# Altium project Encoder.PrjPCB
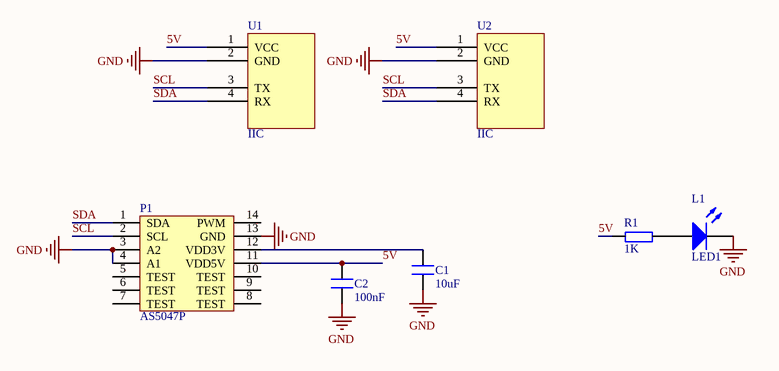
[diagram p0: En_V1.SchDoc]
1 sheet, 7 parts. Net scope: global (net labels, ports and power ports of the same name join across sheets).
Board files: EN_AS5048.PcbDoc, LOGO_Institute.PcbDoc

## Sheet En_V1.SchDoc
size A3

### Parts
C1  10uF  [0603P]
C2  100nF  [0603P]
L1  LED1  [0603_LED]
P1  AS5047P  [TSSOP-14]
R1  1K  [0603P]
U1  IIC  [XH2.54-4]
U2  IIC  [XH2.54-4]

### Nets
GND: C1.1 C2.1 L1.2(K) P1.3(A2) P1.4(A1) P1.13(GND) U1.2(GND) U2.2(GND)
5V: C2.2 P1.11(VDD5V) R1.1 U1.1(VCC) U2.1(VCC)
SCL: P1.2(SCL) U1.3(TX) U2.3(TX)
SDA: P1.1(SDA) U1.4(RX) U2.4(RX)
NetC1_2: C1.2 P1.12(VDD3V)
NetL1_1: L1.1(A) R1.2

Not connected (* = marked no-connect by the designer): P1 5(TEST) 6(TEST) 7(TEST) 8(TEST) 9(TEST) 10(TEST) 14(PWM)

### Library data of the parts
C1 C2 = C
L1 = LED2: Typical RED, GREEN, YELLOW, AMBER GaAs LED; Published: 8-Jun-2000; LatestRevisionDate: 17-Jul-2002; LatestRevisionNote: Re-released for DXP Platform.; PackageDocument: Feb-2002; PackageReference: 3.2X1.6X1.1; Publisher: Altium Limited
P1 = AS5048B-TSSOP14_1
R1 = R
U1 U2 = XH2.54插座-4P